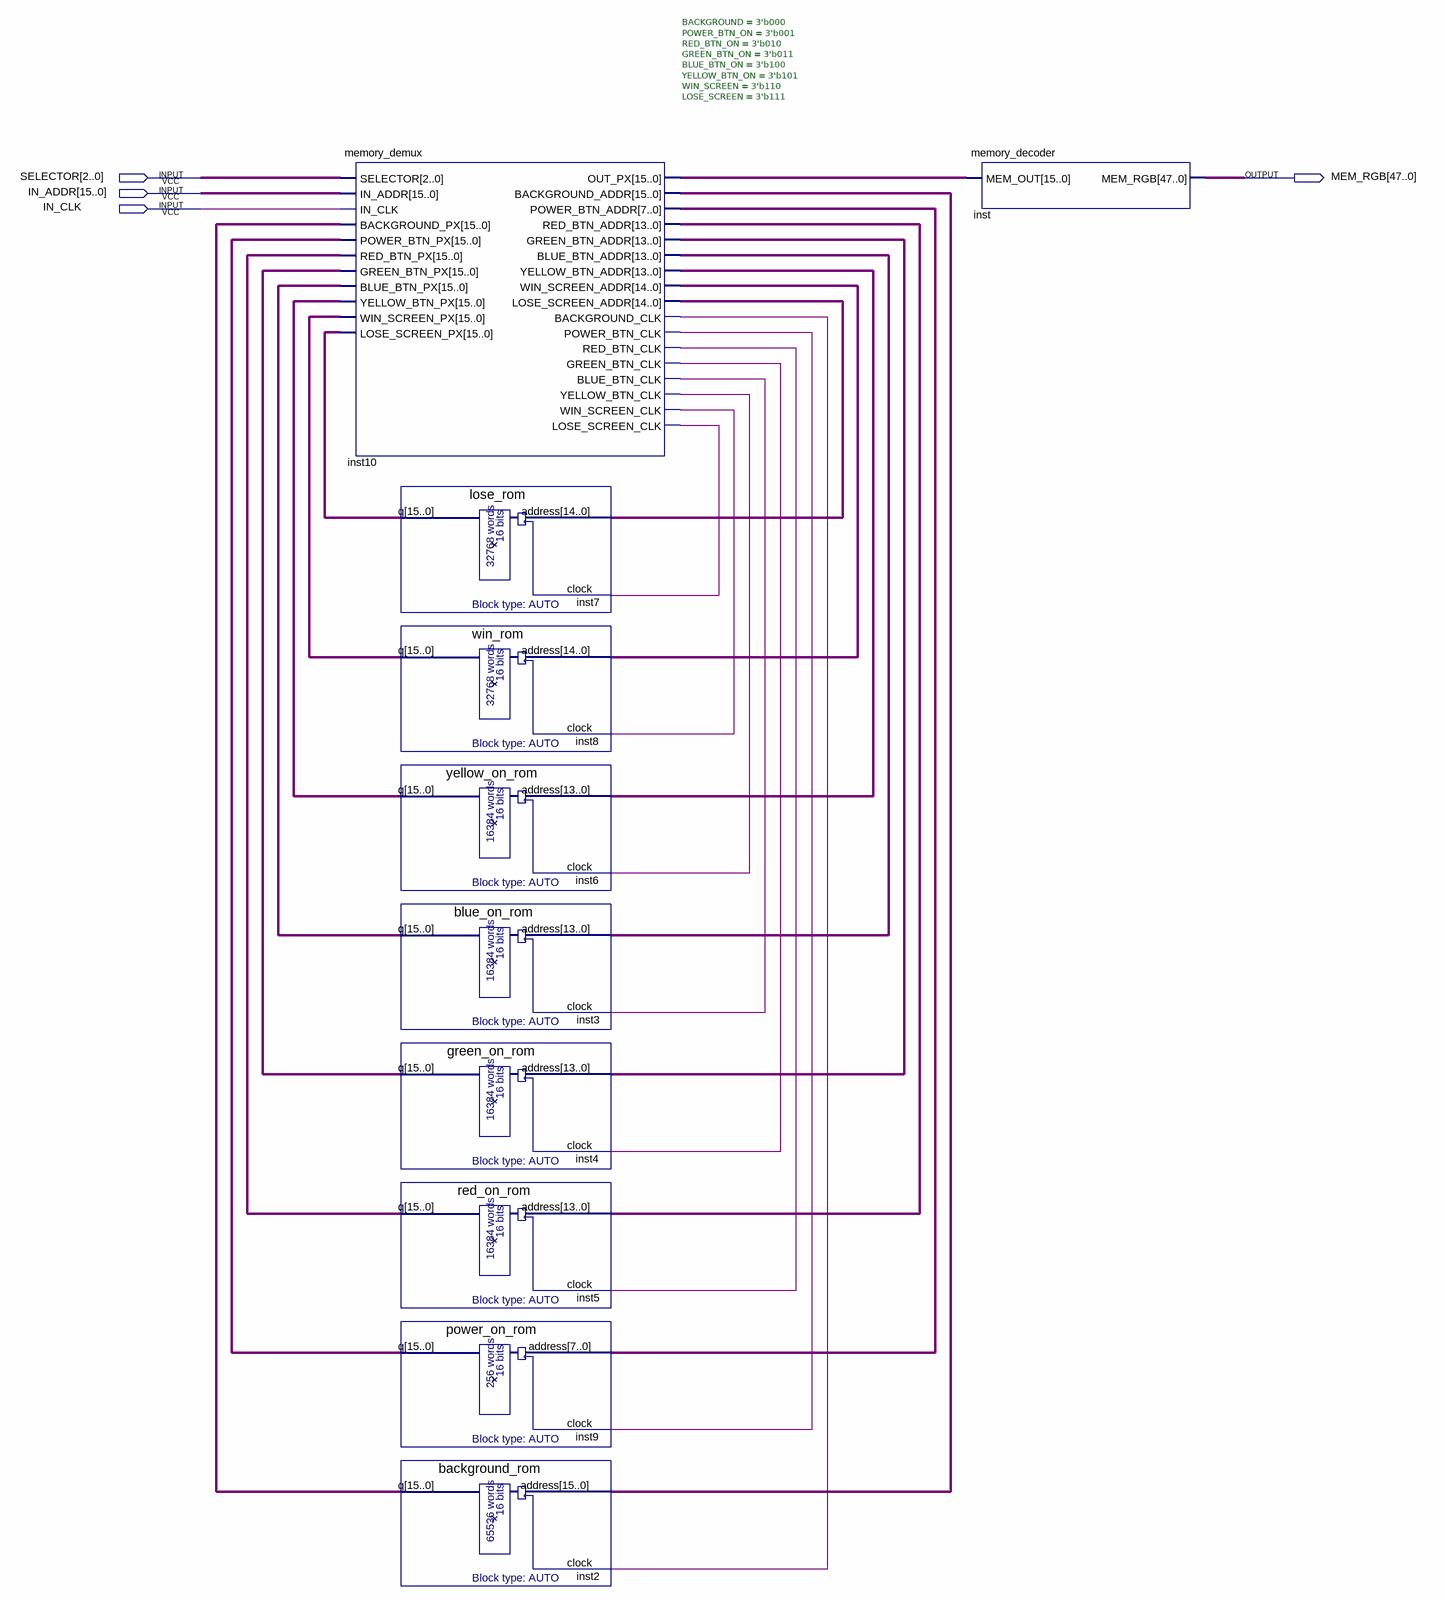
[diagram p0: schematic sheet]
// Quartus schematic memory_block.bdf as structural Verilog: 10 symbols, 4 pins
module memory_block (
  input  [2:0] SELECTOR,
  input  [15:0] IN_ADDR,
  input  IN_CLK,
  output [47:0] MEM_RGB
);

  wire inst10_background_clk, inst10_blue_btn_clk, inst10_green_btn_clk, inst10_lose_screen_clk,
       inst10_power_btn_clk, inst10_red_btn_clk, inst10_win_screen_clk, inst10_yellow_btn_clk;
  wire [7:0] inst10_power_btn_addr;
  wire [13:0] inst10_blue_btn_addr, inst10_green_btn_addr, inst10_red_btn_addr, inst10_yellow_btn_addr;
  wire [14:0] inst10_lose_screen_addr, inst10_win_screen_addr;
  wire [15:0] inst2_q, inst3_q, inst4_q, inst5_q, inst6_q, inst7_q, inst8_q, inst9_q, inst10_background_addr,
       inst10_out_px;

  memory_demux #(.BACKGROUND(3'b000), .POWER_BTN_ON(3'b001), .RED_BTN_ON(3'b010), .GREEN_BTN_ON(3'b011), .BLUE_BTN_ON(3'b100), .YELLOW_BTN_ON(3'b101), .WIN_SCREEN(3'b110), .LOSE_SCREEN(3'b111)) inst10 (
    .SELECTOR(SELECTOR), .IN_ADDR(IN_ADDR), .IN_CLK(IN_CLK), .BACKGROUND_PX(inst2_q), .POWER_BTN_PX(inst9_q),
    .RED_BTN_PX(inst5_q), .GREEN_BTN_PX(inst4_q), .BLUE_BTN_PX(inst3_q), .YELLOW_BTN_PX(inst6_q),
    .WIN_SCREEN_PX(inst8_q), .LOSE_SCREEN_PX(inst7_q), .OUT_PX(inst10_out_px),
    .BACKGROUND_ADDR(inst10_background_addr), .POWER_BTN_ADDR(inst10_power_btn_addr),
    .RED_BTN_ADDR(inst10_red_btn_addr), .GREEN_BTN_ADDR(inst10_green_btn_addr),
    .BLUE_BTN_ADDR(inst10_blue_btn_addr), .YELLOW_BTN_ADDR(inst10_yellow_btn_addr),
    .WIN_SCREEN_ADDR(inst10_win_screen_addr), .LOSE_SCREEN_ADDR(inst10_lose_screen_addr),
    .BACKGROUND_CLK(inst10_background_clk), .POWER_BTN_CLK(inst10_power_btn_clk),
    .RED_BTN_CLK(inst10_red_btn_clk), .GREEN_BTN_CLK(inst10_green_btn_clk),
    .BLUE_BTN_CLK(inst10_blue_btn_clk), .YELLOW_BTN_CLK(inst10_yellow_btn_clk),
    .WIN_SCREEN_CLK(inst10_win_screen_clk), .LOSE_SCREEN_CLK(inst10_lose_screen_clk));
  lose_rom inst7 (.address(inst10_lose_screen_addr), .clock(inst10_lose_screen_clk), .q(inst7_q));
  win_rom inst8 (.address(inst10_win_screen_addr), .clock(inst10_win_screen_clk), .q(inst8_q));
  yellow_on_rom inst6 (.address(inst10_yellow_btn_addr), .clock(inst10_yellow_btn_clk), .q(inst6_q));
  blue_on_rom inst3 (.address(inst10_blue_btn_addr), .clock(inst10_blue_btn_clk), .q(inst3_q));
  green_on_rom inst4 (.address(inst10_green_btn_addr), .clock(inst10_green_btn_clk), .q(inst4_q));
  red_on_rom inst5 (.address(inst10_red_btn_addr), .clock(inst10_red_btn_clk), .q(inst5_q));
  power_on_rom inst9 (.address(inst10_power_btn_addr), .clock(inst10_power_btn_clk), .q(inst9_q));
  background_rom inst2 (.address(inst10_background_addr), .clock(inst10_background_clk), .q(inst2_q));
  memory_decoder inst (.MEM_OUT(inst10_out_px), .MEM_RGB(MEM_RGB));
endmodule
